# Altium schematic sheet TopLevel.SchDoc
size A4
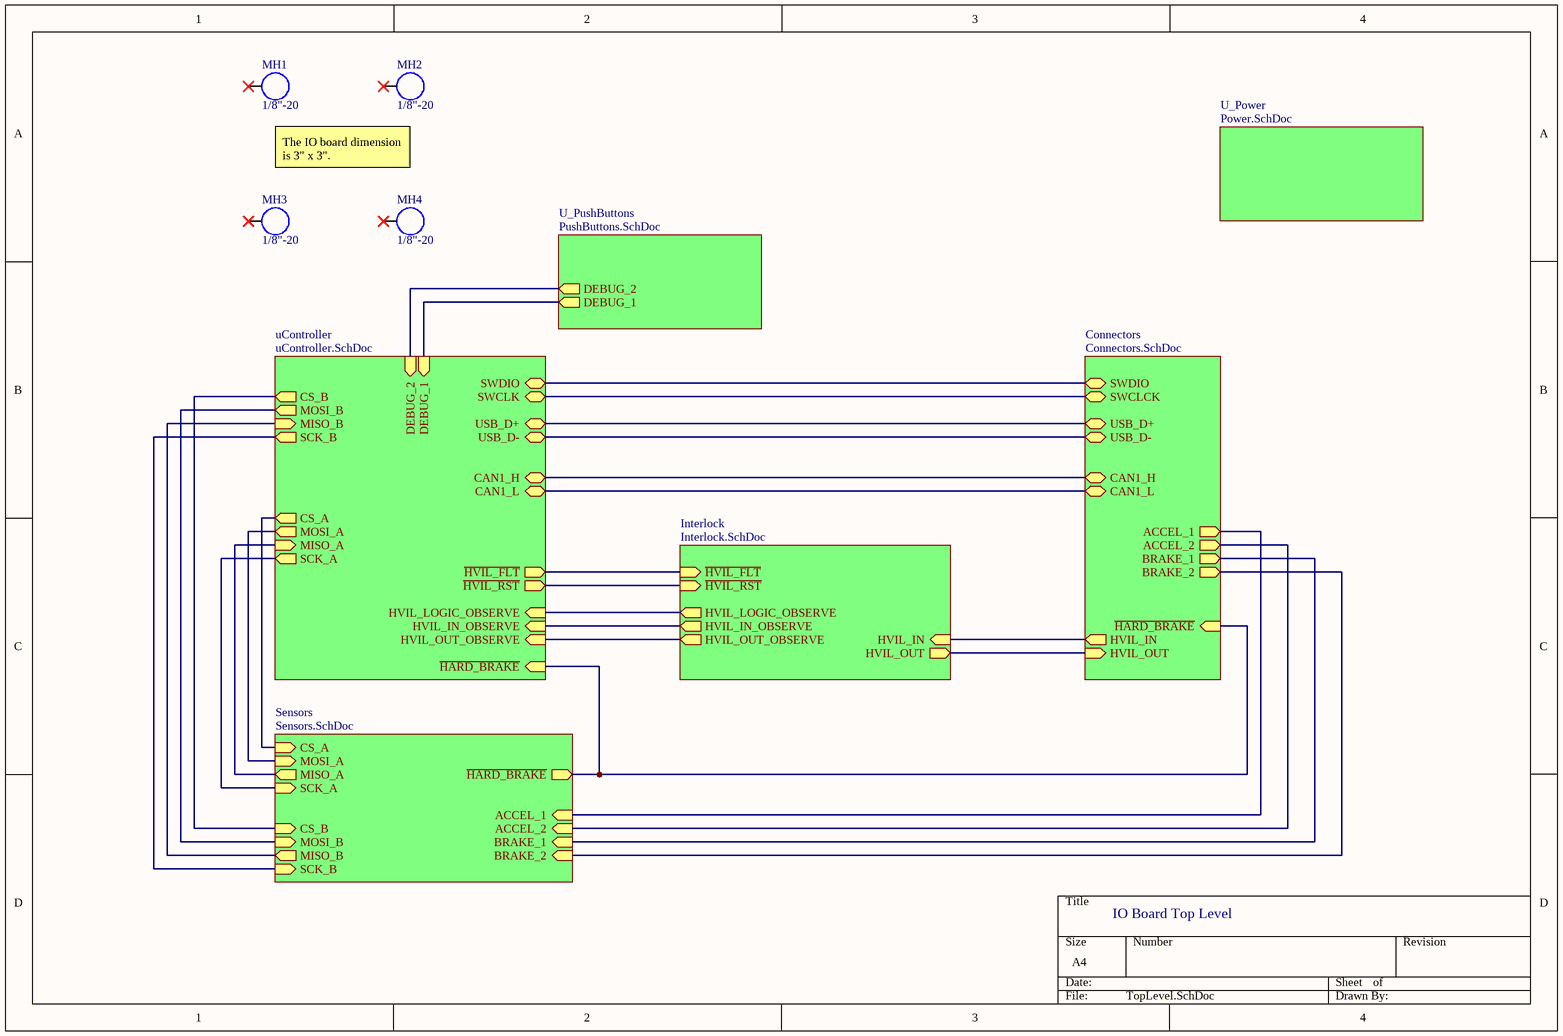
[diagram p0: TopLevel.SchDoc]

## Parts
MH1  1/8"-20  [MOUNTING_HOLE]
MH2  1/8"-20  [MOUNTING_HOLE]
MH3  1/8"-20  [MOUNTING_HOLE]
MH4  1/8"-20  [MOUNTING_HOLE]

## Sub-sheets
Connectors = Connectors.SchDoc: CAN1_L (bidir), SWCLCK (bidir), SWDIO (bidir), USB_D+ (bidir), USB_D- (bidir), HVIL_IN (out), CAN1_H (bidir), HVIL_OUT (in), ACCEL_1 (out), BRAKE_1 (out), BRAKE_2 (out), ACCEL_2 (out), ~{HARD_BRAKE} (in)
Interlock = Interlock.SchDoc: HVIL_OUT_OBSERVE (out), HVIL_OUT (out), ~{HVIL_RST} (in), HVIL_IN (in), HVIL_IN_OBSERVE (out), ~{HVIL_FLT} (in), HVIL_LOGIC_OBSERVE (out)
Sensors = Sensors.SchDoc: ACCEL_2 (in), BRAKE_1 (in), BRAKE_2 (in), ACCEL_1 (in), ~{HARD_BRAKE} (out), MISO_A (out), MOSI_A (in), CS_A (in), SCK_A (in), MISO_B (out), MOSI_B (in), CS_B (in), SCK_B (in)
U_Power = Power.SchDoc: no entries
U_PushButtons = PushButtons.SchDoc: DEBUG_2 (out), DEBUG_1 (out)
uController = uController.SchDoc: HVIL_OUT_OBSERVE (in), HVIL_LOGIC_OBSERVE (in), HVIL_IN_OBSERVE (in), USB_D- (bidir), SWDIO (bidir), SWCLK (bidir), ~{HVIL_RST} (out), USB_D+ (bidir), ~{HVIL_FLT} (out), CAN1_H (bidir), CAN1_L (bidir), CS_B (out), MOSI_B (out), ~{HARD_BRAKE} (in), CS_A (out), MISO_A (in), SCK_A (out), MOSI_A (out), MISO_B (in), SCK_B (out), DEBUG_1 (in), DEBUG_2 (in)

## Nets
(unnamed): sheet uController/HVIL_OUT_OBSERVE, sheet Interlock/HVIL_OUT_OBSERVE
(unnamed): sheet uController/HVIL_LOGIC_OBSERVE, sheet Interlock/HVIL_LOGIC_OBSERVE
(unnamed): sheet uController/HVIL_IN_OBSERVE, sheet Interlock/HVIL_IN_OBSERVE
(unnamed): sheet uController/USB_D-, sheet Connectors/USB_D-
(unnamed): sheet uController/SWDIO, sheet Connectors/SWDIO
(unnamed): sheet uController/SWCLK, sheet Connectors/SWCLCK
(unnamed): sheet uController/~{HVIL_RST}, sheet Interlock/~{HVIL_RST}
(unnamed): sheet uController/USB_D+, sheet Connectors/USB_D+
(unnamed): sheet uController/~{HVIL_FLT}, sheet Interlock/~{HVIL_FLT}
(unnamed): sheet uController/CAN1_H, sheet Connectors/CAN1_H
(unnamed): sheet uController/CAN1_L, sheet Connectors/CAN1_L
(unnamed): sheet uController/CS_B, sheet Sensors/CS_B
(unnamed): sheet uController/MOSI_B, sheet Sensors/MOSI_B
(unnamed): sheet uController/~{HARD_BRAKE}, sheet Connectors/~{HARD_BRAKE}, sheet Sensors/~{HARD_BRAKE}
(unnamed): sheet uController/CS_A, sheet Sensors/CS_A
(unnamed): sheet uController/MISO_A, sheet Sensors/MISO_A
(unnamed): sheet uController/SCK_A, sheet Sensors/SCK_A
(unnamed): sheet uController/MOSI_A, sheet Sensors/MOSI_A
(unnamed): sheet uController/MISO_B, sheet Sensors/MISO_B
(unnamed): sheet uController/SCK_B, sheet Sensors/SCK_B
(unnamed): sheet uController/DEBUG_1, sheet U_PushButtons/DEBUG_1
(unnamed): sheet uController/DEBUG_2, sheet U_PushButtons/DEBUG_2
(unnamed): sheet Connectors/HVIL_IN, sheet Interlock/HVIL_IN
(unnamed): sheet Connectors/HVIL_OUT, sheet Interlock/HVIL_OUT
(unnamed): sheet Connectors/ACCEL_1, sheet Sensors/ACCEL_1
(unnamed): sheet Connectors/BRAKE_1, sheet Sensors/BRAKE_1
(unnamed): sheet Connectors/BRAKE_2, sheet Sensors/BRAKE_2
(unnamed): sheet Connectors/ACCEL_2, sheet Sensors/ACCEL_2

Not connected (* = marked no-connect by the designer): MH1 1*; MH2 1*; MH3 1*; MH4 1*

## Notes on the sheet
- The IO board dimension is 3" x 3".
- IO Board Top Level

## Library data of the parts
MH1-MH4 = Mounting Hole: Mounting Hole for 1/8"-20 Thread Size, 1-1/8" Long Black-Oxide Alloy Steel Socket Head Screw; Screw Specs: https://www.mcmaster.com/91251A560/